# Altium schematic sheet Filtro_Esquematico.SchDoc
size A4
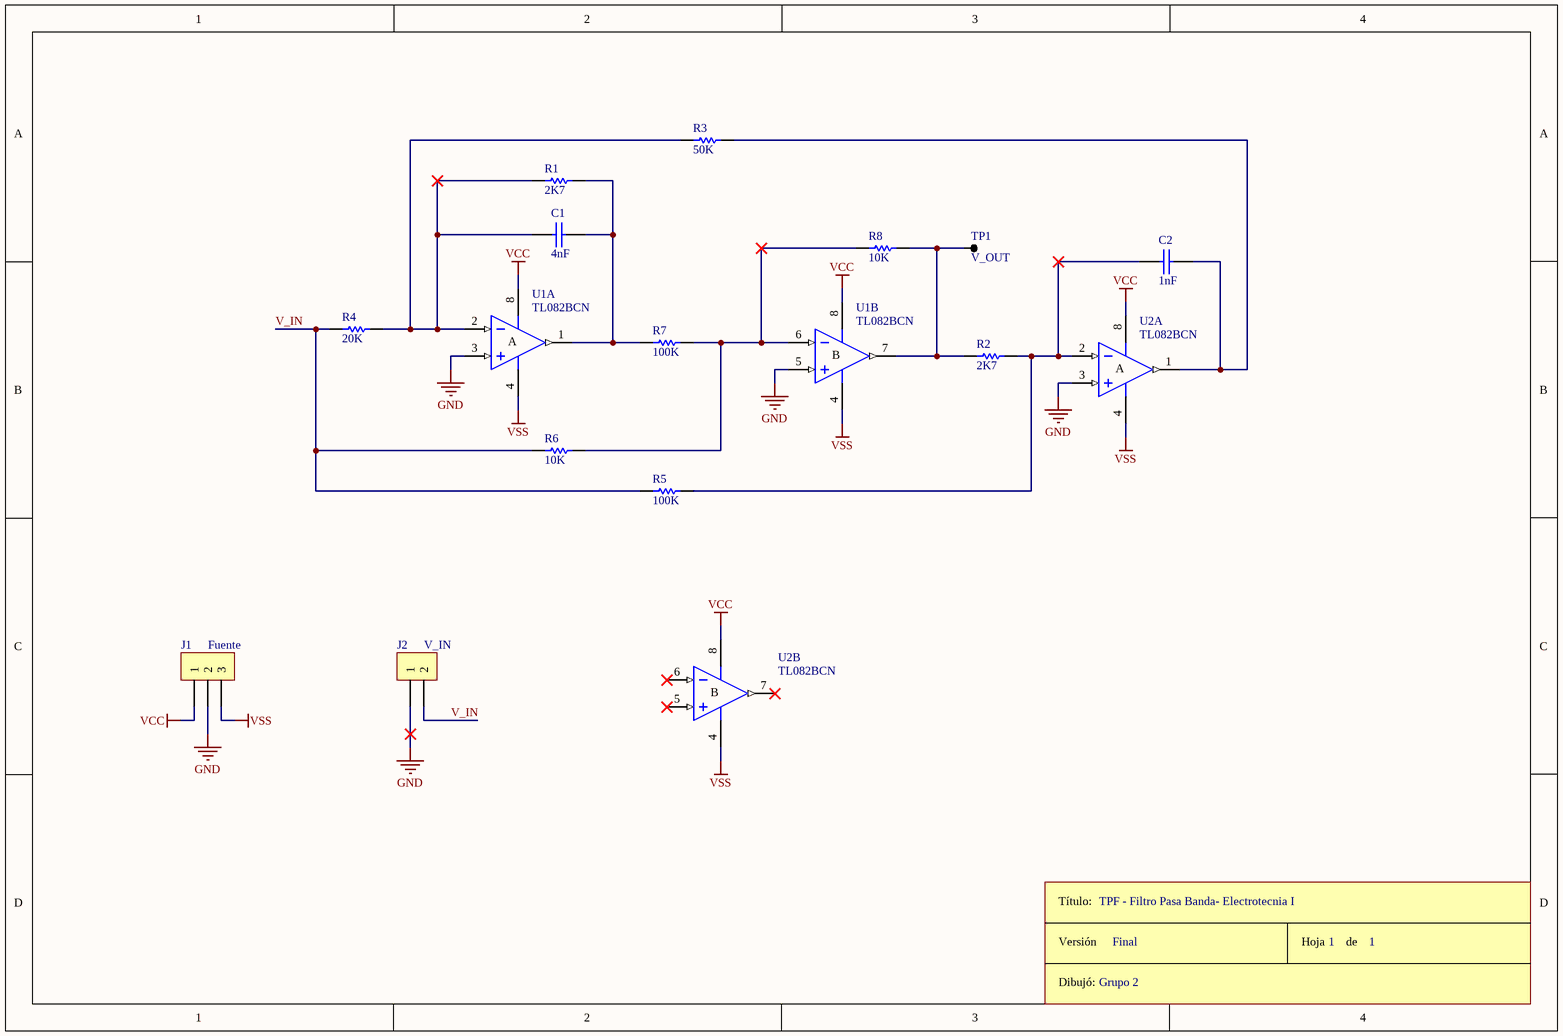
[diagram p0: Filtro_Esquematico.SchDoc]

## Parts
1  Rótulo  (value not drawn)
C1  4nF  [CAP100]
C2  1nF  [CAP100]
J1  Fuente  [BORNERA3]
J2  V_IN  [BORNERA2]
R1  2K7  [RES300]
R2  2K7  [RES300]
R3  50K  [RES300]
R4  20K  [RES300]
R5  100K  [RES300]
R6  10K  [RES300]
R7  100K  [RES300]
R8  10K  [RES300]
TP1  V_OUT  [TPTH]
U1  TL082BCN  [DIP8]  (parts A,B of 2)
U2  TL082BCN  [DIP8]  (parts A,B of 2)

## Nets
GND: J1.2 J2.1 U1.3(IN+) U1.5(IN+) U2.3(IN+)
VCC: J1.1 U1.8(V+) U2.8(V+)
VSS: J1.3 U1.4(V-) U2.4(V-)
V_IN: J2.2 R4.1 R5.1 R6.1
NetC1_1: C1.1 R1.1 R3.1 R4.2 U1.2(IN-)
NetC1_2: C1.2 R1.2 R7.1 U1.1(OUT)
NetC2_1: C2.1 R2.2 R5.2 U2.2(IN-)
NetC2_2: C2.2 R3.2 U2.1(OUT)
NetR2_1: R2.1 R8.2 TP1.1 U1.7(OUT)
NetR6_2: R6.2 R7.2 R8.1 U1.6(IN-)

Not connected (* = marked no-connect by the designer): U2 5(IN+)* 6(IN-)* 7(OUT)*

## Notes on the sheet
- TPF - Filtro Pasa Banda- Electrotecnia I
- Grupo 2
- Final
- 1
- (in symbol Rótulo) Título:; Versión; Hoja       de; Dibujó:
- (in symbol TL082BCN, part A) A
- (in symbol TL082BCN, part B) B

## Library data of the parts
C1 C2 = CAP
J1 = BORNERA 3
J2 = BORNERA 2
R1-R8 = RES
TP1 = TP
U1 U2 = TL082BCN: General-Purpose J-FET Dual Operational Amplifier; Published: 24-Aug-2001; LatestRevisionDate: 06-Jun-2005; LatestRevisionNote: Stylized 3D Model Added.; DatasheetVersion: Jan-1999; PackageReference: DIP8; Publisher: Altium Limited; PackageDescription: DIP; 8 Leads; Row Spacing 7.62 mm; Pitch 2.54 mm; Code_JEDEC: MO-001-AN; ComponentLink1Description: Manufacturer Link; ComponentLink1URL: http://www.st.com/; ComponentLink2Description: Datasheet; ComponentLink2URL: http://www.st.com/stonline/products/literature/ds/2300/tl082.pdf